# EAGLE design IAQ_Shield (EAGLE 7.6.0)
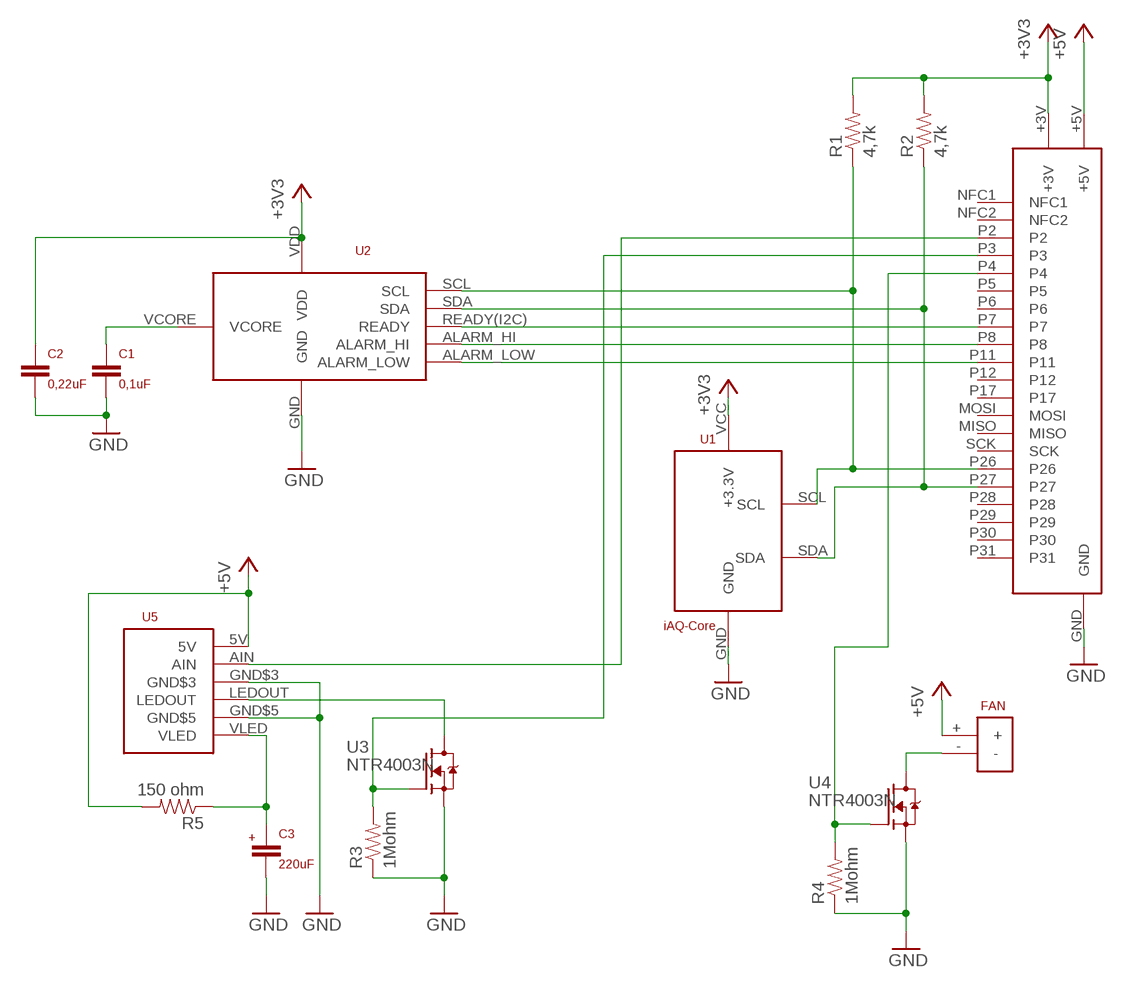
[diagram p0: schematic, sheet 1]

## Parts
C1  0,1uF  0.1UF-08050805  [0805]
C2  0,22uF  0.22UF-08050805  [0805]
C3  220uF  ELECTROLYTIC_CAPACITOR_220UFUWT1C221MCL1GS  [UWT1C221MCL1GS_ALUMINIUM]
FAN  POWER_SOLDER_PADS_2P  [POWER_SOLDER_PADS_2P]
R1  4,7k  510OHM1/4W1%(0805)  [0805]
R2  4,7k  510OHM1/4W1%(0805)  [0805]
R3  1Mohm  510OHM1/4W1%(0805)  [0805]
R4  1Mohm  510OHM1/4W1%(0805)  [0805]
R5  150 ohm  510OHM1/4W1%(0805)  [0805]
U1  iAQ-Core  IAQ-CORE  [IAQ-CORE]
U2  CHIPCAP2  [CHIPCAP2]
U3  NTR4003N  [SOT23]
U4  NTR4003N  [SOT23]
U5  DN7C3CA006  [DN7C3CA006]
U$1  EE02_SHIELD_HEADERSHIELD  [EE02_SHIELD_HEADER]

## Nets
+3V3: C2.1 R1.2 R2.2 U1.VCC(+3.3V) U2.VDD U$1.+3V
+5V: FAN.+ R5.2 U5.5V U$1.+5V
GND: C1.2 C2.2 C3.- R3.1 R4.1 U1.GND U2.GND U3.2(S) U4.2(S) U5.GND$3 U5.GND$5 U$1.GND
N$1: R2.1 U1.SDA U2.SDA U$1.P27
N$2: R1.1 U1.SCL U2.SCL U$1.P26
N$3: U5.AIN U$1.P2
N$4: U3.3(D) U5.LEDOUT
N$5: U2.READY(I2C)(READY) U$1.P7
N$6: C1.1 U2.VCORE
N$7: U2.ALARM_HI U$1.P8
N$8: U2.ALARM_LOW U$1.P11
N$9: R3.2 U3.1(G) U$1.P3
N$10: C3.+ R5.1 U5.VLED
N$11: R4.2 U4.1(G) U$1.P4
N$12: FAN.- U4.3(D)
Unconnected: U$1.MISO U$1.MOSI U$1.NFC1 U$1.NFC2 U$1.P5 U$1.P6 U$1.P12 U$1.P17 U$1.P28 U$1.P29 U$1.P30 U$1.P31 U$1.SCK

## Library data of the parts
C1 = EE:0.1UF-0805
C2 = EE:0.22UF-0805
C3 = EE:ELECTROLYTIC_CAPACITOR_220UF
FAN = EE:POWER_SOLDER_PADS_2P
R1-R5 = EE:510OHM1/4W1%(0805): 510 Ohm; VALUE: 510 ohm
U1 = EE:IAQ-CORE
U2 = EE:CHIPCAP2
U3 U4 = EE:NTR4003N
U5 = EE:DN7C3CA006
U$1 = EE:EE02_SHIELD_HEADER

## Board
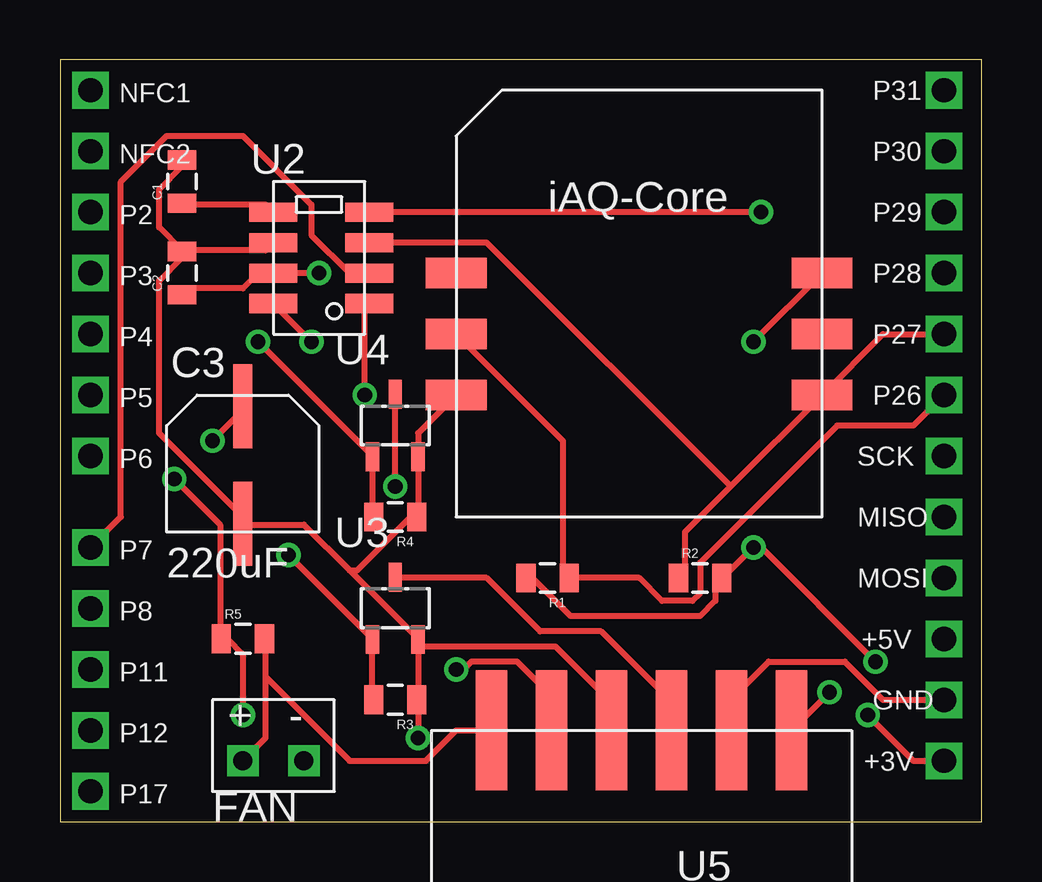
[diagram p1: board, top side]
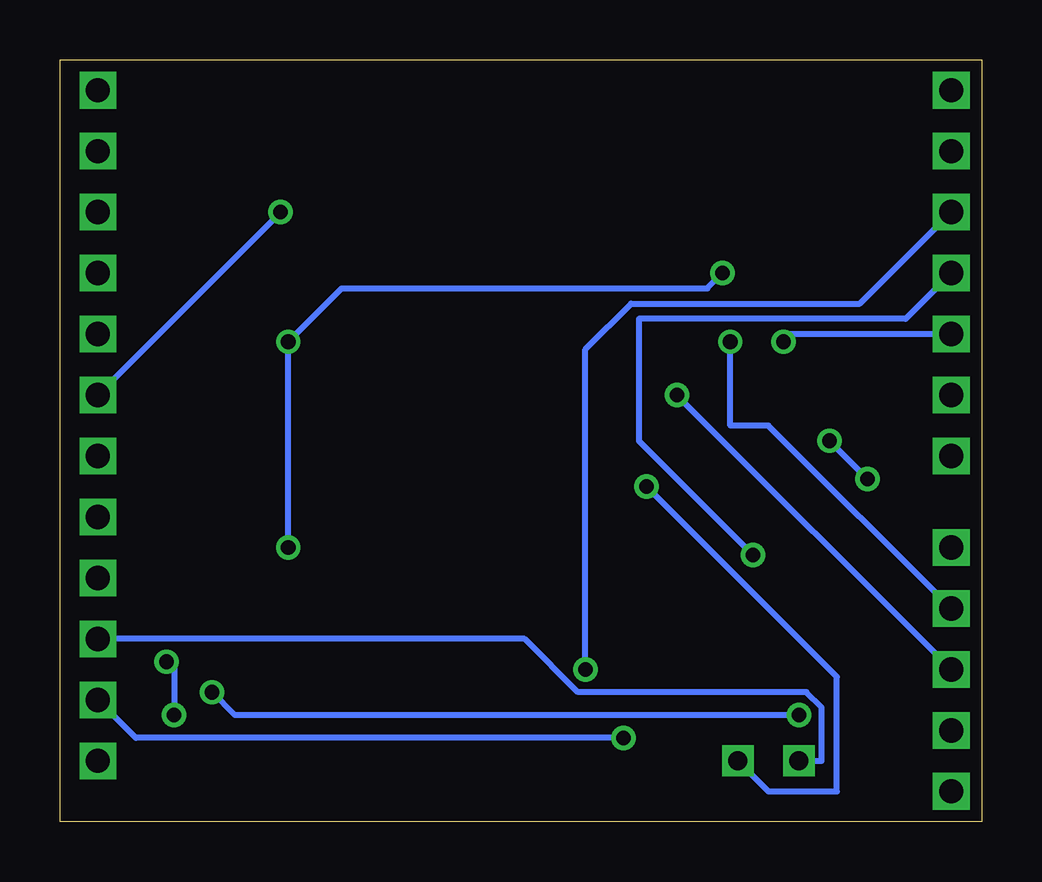
[diagram p2: board, bottom side, seen from below]

Size 38.41 x 31.74 mm. Coordinates in mm from the lower left corner, seen from the top.
Outline: 0,0 38.41,0 38.41,31.74 0,31.74 0,0
Copper layers (1*16): Top 0.035mm / dielectric 1.5mm / Bottom 0.035mm
Design rules "default": minimum track width 10mil, minimum drill 24mil, track to track 8mil, track to pad 8mil, pad to pad 8mil, via to via 8mil, smd to smd 8mil, copper to edge 40mil, drill to drill 8mil, minimum pad ring 10mil, minimum via ring 8mil, stop-mask expansion 4mil, vias tented up to drill 0mil, thermal gap 10mil

### Footprints (pad centres in the part's own frame; a part is rotated, then mirrored left to right if it is on the bottom)
0805 = smd 0.8 x 1.2: 1 -0.9,0; 2 0.9,0
UWT1C221MCL1GS_ALUMINIUM = smd 0.8 x 3.5: + 0,0.8; - 0,-4.1
POWER_SOLDER_PADS_2P = drill 0.8 square: + 0,0; - 2.54,0
IAQ-CORE = smd 2.54 x 1.27: GND -7.62,-3.81; NC -7.62,1.27; NC$2 7.62,-1.27; SCL -7.62,-1.27; SDA 7.62,-3.81; VCC 7.62,1.27
CHIPCAP2 = smd 2 x 0.8: ALARM_HI 0,0; ALARM_LOW 4,0; GND 0,2.54; READY(I2C) 4,1.27; SCL 4,3.81; SDA 4,2.54; VCORE 0,3.81; VDD 0,1.27
SOT23 = smd 0.55 x 1.2: 1 -0.95,-1.3; 2 0.95,-1.3; 3 0,1.3
DN7C3CA006 = smd 1.3 x 5: 5V 12.5,0; AIN 10,0; GND$3 7.5,0; GND$5 2.5,0; LEDOUT 5,0; VLED 0,0
EE02_SHIELD_HEADER = drill 1.016 square: +3V 35.56,2.54; +5V 35.56,7.62; GND 35.56,5.08; MISO 35.56,12.7; MOSI 35.56,10.16; NFC1 0,30.48; NFC2 0,27.94; P2 0,25.4; P3 0,22.86; P4 0,20.32; P5 0,17.78; P6 0,15.24; P7 0,11.43; P8 0,8.89; P11 0,6.35; P12 0,3.81; P17 0,1.27; P26 35.56,17.78; P27 35.56,20.32; P28 35.56,22.86; P29 35.56,25.4; P30 35.56,27.94; P31 35.56,30.48; SCK 35.56,15.24

### Placement (x,y rotation side)
C1  5.08,26.67 90 top
C2  5.08,22.86 90 top
C3  7.62,16.51 0 top
FAN  7.62,2.54 0 top
R1  20.32,10.16 180 top
R2  26.67,10.16 0 top
R3  13.97,5.08 180 top
R4  13.97,12.7 180 top
R5  7.62,7.62 0 top
U1  24.13,21.59 0 top
U2  8.89,21.59 0 top
U3  13.97,8.89 0 top
U4  13.97,16.51 0 top
U5  30.48,3.81 180 top
U$1  1.27,0 0 top

### Tracks (layer width: path | path; a pad name or v marks a point on that pad's centre or on a via)
+3V3  (via drill 0.61)
  Top 0.254: C2.1 5.08,22.23 7.62,22.23 8.26,22.86 U2.VDD v10.79,22.86 | R1.2 19.68,10.16 21.27,8.57 26.67,8.57 27.3,9.21 27.3,10.16 R2.2 27.62,10.16 v28.89,11.43 29.21,11.43 v33.97,6.67 | v28.89,20 U1.VCC | U$1.+3V 35.56,2.54 v33.66,4.45
  Bottom 0.254: v28.89,11.43 v28.89,20 26.67,22.23 11.43,22.23 v10.79,22.86 | v33.66,4.45 33.66,6.67 v33.97,6.67
+5V
  Top 0.254: 8.57,6.03 8.57,3.49 FAN.+ | 8.57,6.03 8.57,7.62 R5.2 | U5.5V 16.51,3.81 15.24,2.54 12.06,2.54 8.57,6.03
  Bottom 0.254: U$1.+5V 19.05,7.62 16.83,5.4 7.3,5.4 6.67,4.76 6.67,2.54 FAN.+
GND  (via drill 0.61)
  Top 0.254: U$1.GND 34.29,5.08 32.7,6.67 29.53,6.67 28.26,5.4 28.26,3.81 U5.GND$5 | U1.GND 14.92,16.19 14.92,15.24 U4.2 14.92,14.92 14.92,12.7 R4.1 14.61,12.7 12.38,10.48 12.06,10.48 | 5.08,23.81 8.57,23.81 U2.GND | 5.08,23.81 4.13,24.77 4.13,26.35 5.08,27.3 C1.2 | 5.08,23.81 C2.2 5.08,23.5 4.13,22.54 4.13,16.19 7.62,12.7 C3.- 7.62,12.38 10.16,12.38 12.06,10.48 | 14.92,7.3 14.92,5.08 | 12.06,10.48 14.92,7.62 U3.2 14.92,7.3 | 14.92,7.3 20.64,7.3 22.86,5.08 22.86,3.81 U5.GND$3 | 14.92,5.08 v14.92,3.49 | 14.92,5.08 R3.1
  Bottom 0.254: U$1.GND 35.24,3.49 v14.92,3.49
N$1
  Top 0.254: 27.94,13.97 U1.SDA 34.29,20.32 U$1.P27 | 27.94,13.97 26.04,12.06 26.04,10.16 R2.1 | U2.SDA 17.78,24.13 27.94,13.97
N$2  (via drill 0.61)
  Top 0.254: U1.SCL 20.95,15.88 20.95,10.16 R1.1 24.13,10.16 25.08,9.21 26.35,9.21 26.67,9.53 26.67,10.79 32.38,16.51 35.56,16.51 U$1.P26 | v29.21,25.4 U2.SCL
  Bottom 0.254: U$1.P26 v29.21,25.4
N$3  (via drill 0.61)
  Top 0.254: v16.51,6.35 16.83,6.35 17.14,6.67 19.05,6.67 20.32,5.4 20.32,3.81 U5.AIN
  Bottom 0.254: U$1.P2 5.08,21.59 14.61,21.59 16.51,19.68 v16.51,6.35
N$4
  Top 0.254: U3.3 13.97,10.16 17.78,10.16 20,7.94 22.54,7.94 25.4,5.08 25.4,3.81 U5.LEDOUT
N$5
  Top 0.254: U2.READY(I2C) 12.06,22.86 10.48,24.45 10.48,25.72 7.62,28.57 4.45,28.57 2.54,26.67 2.54,12.7 U$1.P7
N$6
  Top 0.254: U2.VCORE 8.57,25.72 5.08,25.72 C1.1
N$7  (via drill 0.61)
  Top 0.254: v10.48,20 U2.ALARM_HI
  Bottom 0.254: v10.48,20 10.48,16.51 8.89,16.51 U$1.P8
N$8  (via drill 0.61)
  Top 0.254: v12.7,17.78 12.7,21.59 U2.ALARM_LOW
  Bottom 0.254: U$1.P11 v12.7,17.78
N$9  (via drill 0.61)
  Top 0.254: R3.2 13.02,5.08 13.02,7.3 U3.1 13.02,7.62 v9.53,11.11
  Bottom 0.254: v9.53,11.11 14.29,15.88 14.29,20.95 3.17,20.95 U$1.P3
N$10  (via drill 0.61)
  Top 0.254: v4.76,14.29 6.67,12.38 6.67,7.62 R5.1 6.99,7.62 7.62,6.99 v7.62,4.45 | v6.35,15.88 7.62,17.14 C3.+ | v32.07,5.4 U5.VLED
  Bottom 0.254: v6.35,15.88 v4.76,14.29 | v32.07,5.4 31.11,4.45 v7.62,4.45
N$11  (via drill 0.61)
  Top 0.254: R4.2 13.02,12.7 13.02,14.92 U4.1 13.02,15.24 v8.26,20
  Bottom 0.254: v8.26,20 7.94,20.32 U$1.P4
N$12  (via drill 0.61)
  Top 0.254: v13.97,13.97 U4.3
  Bottom 0.254: v13.97,13.97 6.03,6.03 6.03,1.27 8.89,1.27 FAN.-